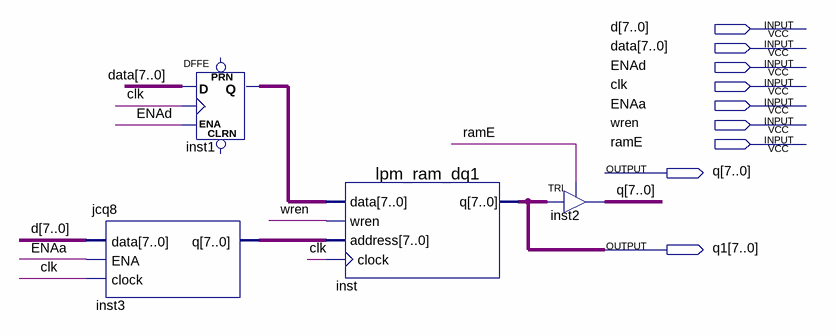
[diagram p0: schematic sheet]
// Quartus schematic ram.bdf as structural Verilog: 4 symbols, 9 pins
module ram (
  input  [7:0] d,
  input  [7:0] data,
  input  ENAd,
  input  clk,
  input  ENAa,
  input  wren,
  input  ramE,
  output [7:0] q,
  output [7:0] q1
);

  wire [7:0] inst1_q, inst3_q;

  jcq8 inst3 (.data(d), .ENA(ENAa), .clock(clk), .q(inst3_q));
  DFFE inst1[7:0] (.D(data), .CLK(clk), .ENA(ENAd), .Q(inst1_q));  // open: PRN, CLRN
  lpm_ram_dq1 inst (.data(inst1_q), .wren(wren), .address(inst3_q), .clock(clk), .q(q1));
  TRI inst2[7:0] (.IN(q1), .OE(ramE), .OUT(q));
endmodule
